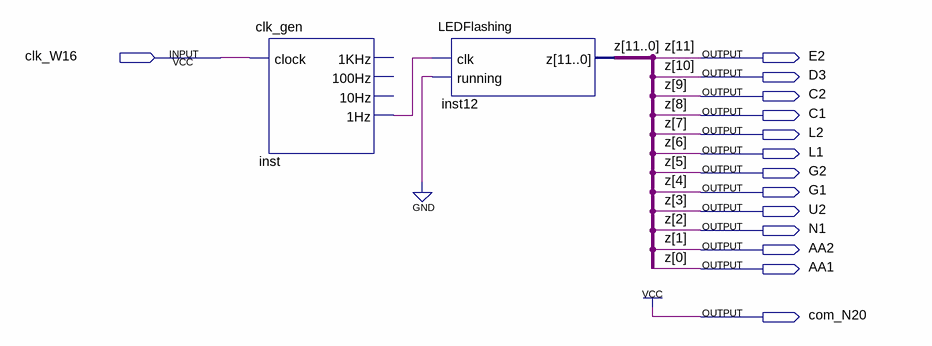
[diagram p0: schematic sheet]
// Quartus schematic LEDCounterTest.bdf as structural Verilog: 2 symbols, 14 pins
module LEDCounterTest (
  input  clk_W16,
  output E2,
  output D3,
  output C2,
  output C1,
  output L2,
  output L1,
  output G2,
  output G1,
  output U2,
  output N1,
  output AA2,
  output AA1,
  output com_N20
);

  wire inst_1hz;

  clk_gen inst (.clock(clk_W16), .\1Hz (inst_1hz));  // open: 1KHz, 100Hz, 10Hz
  LEDFlashing inst12 (.clk(inst_1hz), .running(1'b0), .z({E2, D3, C2, C1, L2, L1, G2, G1, U2, N1, AA2, AA1}));

  assign com_N20 = 1'b1;

  // Other names for the same wires on the sheet: z[11:0] = {E2, D3, C2, C1, L2, L1, G2, G1, U2, N1, AA2, AA1}
endmodule
